# EAGLE schematic BD0008_1 (1x) (EAGLE 9.6.2)
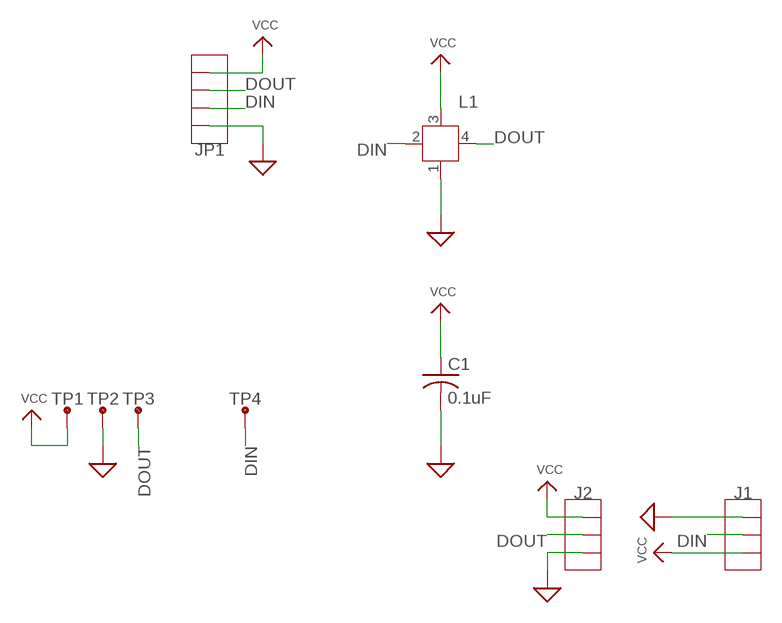
[diagram p0: schematic, sheet 1]

## Parts
C1  0.1uF  C-USC0402  [C0402]
J1  HEADER_1X3MALE  [M3SMD]
J2  HEADER_1X3FEMALE  [F3SMD]
JP1  HEADER_1X4S  [1X04]
L1  WS2812B  [SK6812]
TP1  VCC  TEST_POINT  [TEST_POINT]
TP2  GND  TEST_POINT  [TEST_POINT]
TP3  DOUT  TEST_POINT  [TEST_POINT]
TP4  DIN  TEST_POINT  [TEST_POINT]

## Nets
DIN: J1.2 JP1.2 L1.2(DIN) TP4.P$1
DOUT: J2.2A J2.2B JP1.3 L1.4(DOUT) TP3.P$1
GND: C1.2 J1.1 J2.3A J2.3B JP1.1 L1.1(VSS) TP2.P$1 ; supply symbol labelled SUP
VCC: C1.1 J1.3 J2.1A J2.1B JP1.4 L1.3(VDD) TP1.P$1

## Library data of the parts
C1 = adafruit:C-US: CAPACITOR, American symbol
J1 J2 = Clock:HEADER_1X3
JP1 = Clock:HEADER_1X4S
L1 = Clock:WS2812B
TP1-TP4 = Clock:TEST_POINT